# Altium project CircleBatBoard.PrjPCB
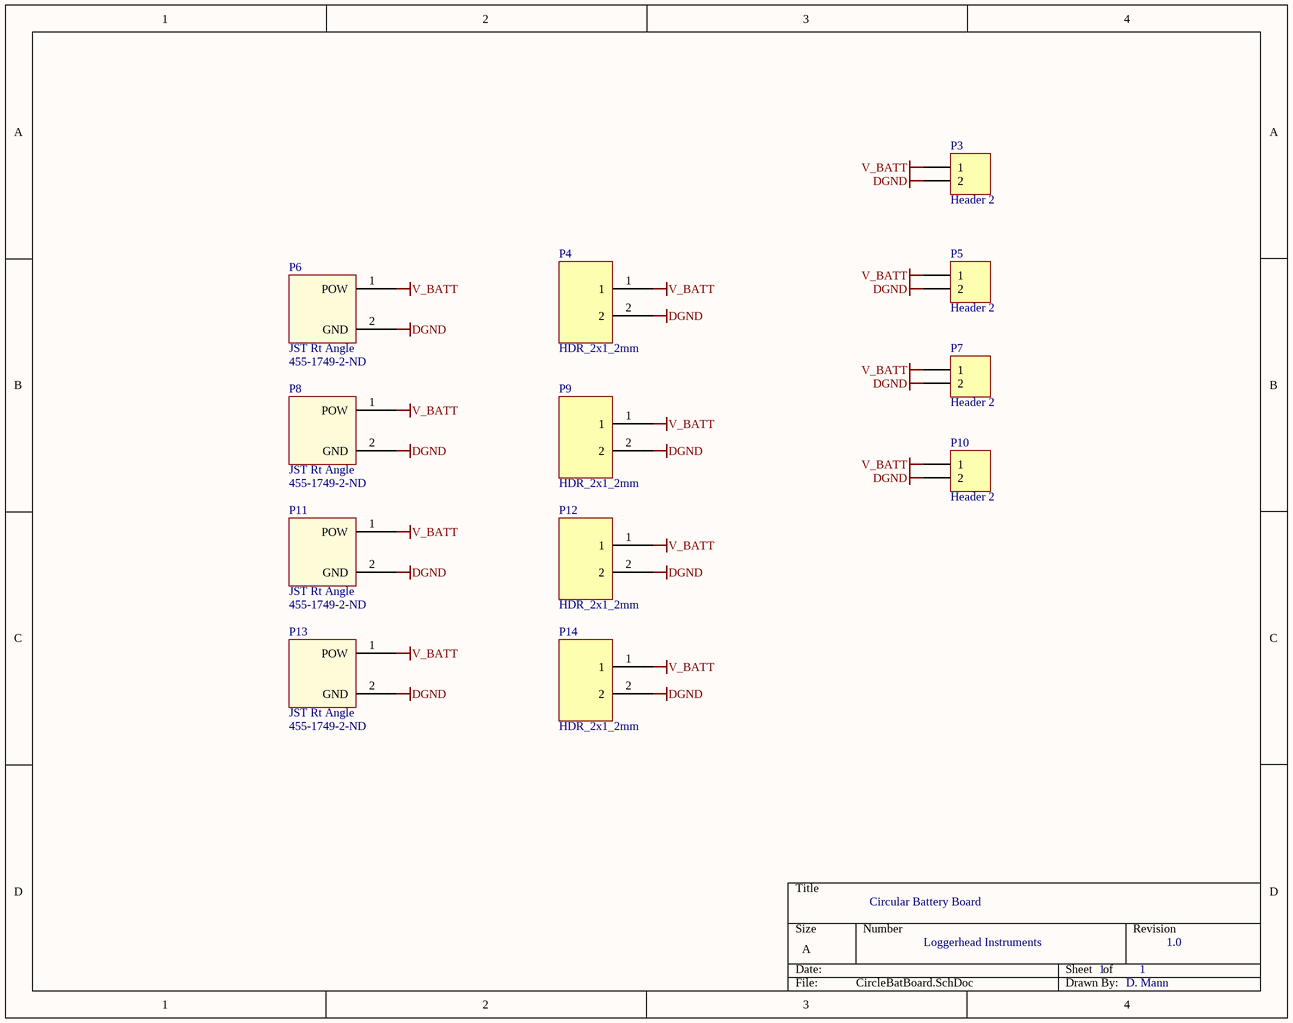
[diagram p0: CircleBatBoard.SchDoc]
1 sheet, 12 parts. Net scope: global (net labels, ports and power ports of the same name join across sheets).
Board file: CircleBatBoard.PcbDoc

## Sheet CircleBatBoard.SchDoc
size A

### Parts
P3  Header 2  [HDR1X2]
P4  HDR_2x1_2mm  [HDR_2x1_2mm]
P5  Header 2  [HDR1X2]
P6  JST Rt Angle  Supplier Part Number 1: 455-1749-2-ND  [JST_2SMT]
P7  Header 2  [HDR1X2]
P8  JST Rt Angle  Supplier Part Number 1: 455-1749-2-ND  [JST_2SMT]
P9  HDR_2x1_2mm  [HDR_2x1_2mm]
P10  Header 2  [HDR1X2]
P11  JST Rt Angle  Supplier Part Number 1: 455-1749-2-ND  [JST_2SMT]
P12  HDR_2x1_2mm  [HDR_2x1_2mm]
P13  JST Rt Angle  Supplier Part Number 1: 455-1749-2-ND  [JST_2SMT]
P14  HDR_2x1_2mm  [HDR_2x1_2mm]

### Nets
DGND: P3.2 P4.2 P5.2 P6.2(GND) P7.2 P8.2(GND) P9.2 P10.2 P11.2(GND) P12.2 P13.2(GND) P14.2
V_BATT: P3.1 P4.1 P5.1 P6.1(POW) P7.1 P8.1(POW) P9.1 P10.1 P11.1(POW) P12.1 P13.1(POW) P14.1

### Notes on the sheet
- Circular Battery Board
- Loggerhead Instruments
- 1
- 1.0
- D. Mann

### Library data of the parts
P3 P5 P7 P10 = Header 2: Header, 2-Pin; LatestRevisionDate: 17-Jul-2002; LatestRevisionNote: Re-released for DXP Platform.; Publisher: Altium Limited
P6 P8 P11 P13 = JSTsmtRtAngle: Supplier 1: Digi-Key